# Altium schematic sheet RECEPTOR_AIS_HF_R00.SchDoc
size A4; SheetNumber: 2; SheetTotal: 5
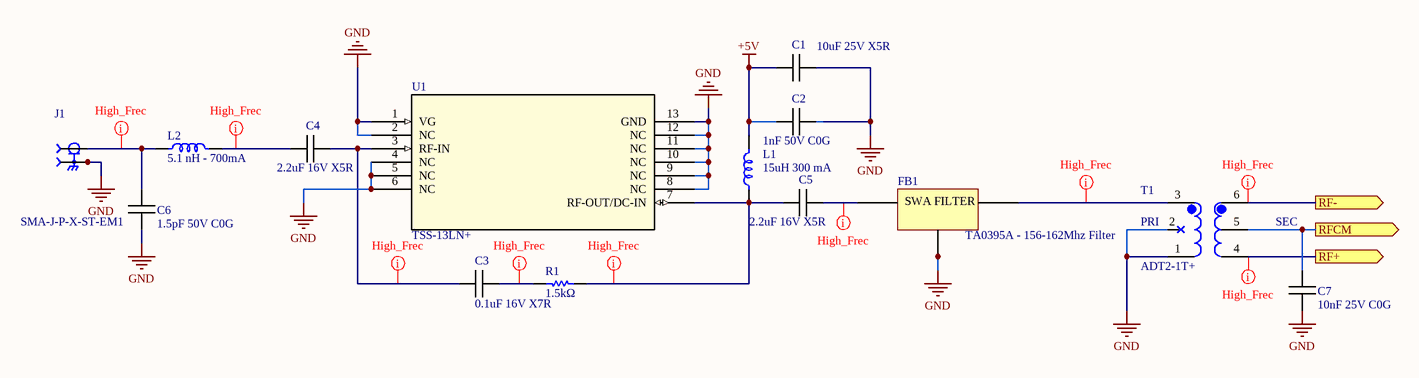
[diagram p0: RECEPTOR_AIS_HF_R00.SchDoc]

## Parts
C1  10uF 25V X5R  [C_0805]
C2  1nF 50V C0G  [C_0603]
C3  0.1uF 16V X7R  [C_0603]
C4  2.2uF 16V X5R  [C_0603]
C5  2.2uF 16V X5R  [C_0603]
C6  1.5pF 50V C0G  [C_0603]
C7  10nF 25V C0G  [C_0603]
FB1  TA0395A - 156-162Mhz Filter  [TA0395A]
J1  SMA-J-P-X-ST-EM1  [CONN_SMA-J-P-H-ST-EM1_SAI]
L1  15uH 300 mA  [IND_LQH32DN150K53L]
L2  5.1 nH - 700mA  [L_0603]
R1  1.5kΩ  [R_0603]
T1  ADT2-1T+  [CD542_MNC]
U1  TSS-13LN+  [TSS-13LN+]

## Ports
RF+ (out, see RECEPTOR_AIS_BLK_R00[2A], RECEPTOR_AIS_DEMOD_R00[2A]), RF- (out, see RECEPTOR_AIS_BLK_R00[2B], RECEPTOR_AIS_DEMOD_R00[2A]), RFCM (out, see RECEPTOR_AIS_BLK_R00[2B], RECEPTOR_AIS_DEMOD_R00[2A])

## Nets
+5V: C1.2 C2.1 L1.2
GND: C1.1 C2.2 C6.1 C7.1 FB1.1 FB1.3 FB1.4 FB1.5 FB1.6 FB1.8 FB1.9 FB1.10 J1.2 J1.3 T1.1 T1.2 U1.1(VG) U1.2(NC) U1.4(NC) U1.5(NC) U1.6(NC) U1.8(NC) U1.9(NC) U1.10(NC) U1.11(NC) U1.12(NC) U1.13(GND)
RF+: T1.4 ; port RF+
RF-: T1.6 ; port RF-
RFCM: C7.2 T1.5 ; port RFCM
NetC3_1: C3.1 C4.2 U1.3(RF-IN)
NetC3_2: C3.2 R1.2
NetC4_1: C4.1 L2.2
NetC5_1: C5.1 L1.1 R1.1 U1.7(RF-OUT/DC-IN)
NetC5_2: C5.2 FB1.7
NetC6_2: C6.2 J1.1 L2.1
NetFB1_2: FB1.2 T1.3

## Layout directives
net class RF_50Ohm: NetC3_1, NetC3_2, NetC4_1, NetC5_1, NetC5_2, NetC6_2, NetFB1_2, RF+, RF-

## Notes on the sheet
- (in symbol ADT2-1T+) PRI; SEC
- (in symbol TA0395A) SWA FILTER

## Library data of the parts
C1 = Capacitor NP: 10 µF ±10% 25V Ceramic Capacitor X5R 0805 (2012 Metric)
C2 = Capacitor NP: 1000 pF ±5% 50V Ceramic Capacitor C0G, NP0 0603 (1608 Metric)
C3 = Capacitor NP: 0.1 µF ±10% 16V Ceramic Capacitor X7R 0603 (1608 Metric)
C4 C5 = Capacitor NP: 2.2 µF ±10% 16V Ceramic Capacitor X5R 0603 (1608 Metric)
C6 = Capacitor NP: 1.5 pF ±0.25pF 50V Ceramic Capacitor C0G, NP0 0603 (1608 Metric)
C7 = Capacitor NP: 10000 pF ±5% 25V Ceramic Capacitor C0G, NP0 0603 (1608 Metric)
FB1 = TA0395A: 159.1625MHz Frequency Wireless RF SAW Filter (Surface Acoustic Wave) 3.8dB 5.725MHz Bandwidth 10-SMD, No Lead
J1 = SMA-J-P-X-ST-EM1: SMA Connector Jack, Female Socket 50 Ohms Board Edge, Cutout; Surface Mount Solder; MF: Samtec; MP: SMA-J-P-H-ST-EM3; SnapEDA_Link: https://www.snapeda.com/parts/SMA-J-P-H-ST-EM3/Samtec+Inc./view-part/?ref=snap; Package: None; Value: *; Check_prices: https://www.snapeda.com/parts/SMA-J-P-H-ST-EM3/Samtec+Inc./view-part/?ref=eda
L1 = IND: LQH32DN150K53L - 15 µH Unshielded Drum Core, Wirewound Inductor 300 mA 754mOhm Max Nonstandard
L2 = IND: LQW18AS5N1J00D - 5.1 nH Unshielded Wirewound Inductor 700 mA 140mOhm Max 0603 (1608 Metric)
R1 = Res1: 1.5 kΩ ±1% 0.1W, 1/10W Chip Resistor 0603 (1608 Metric) Moisture Resistant Thick Film
T1 = ADT2-1T+: Description; Manufacturer_Name: Mini Circuits; Type: Balun; Copyright: Copyright (C) 2026 Ultra Librarian. All rights reserved.; Manufacturer_Part_Number: ADT2-1T+; RefDes: RefDes
U1 = TSS-13LN+: Description; Manufacturer_Name: Mini Circuits; Copyright: Copyright (C) 2025 Ultra Librarian. All rights reserved.; Manufacturer_Part_Number: TSS-13LN+; RefDes: RefDes; Type: Type